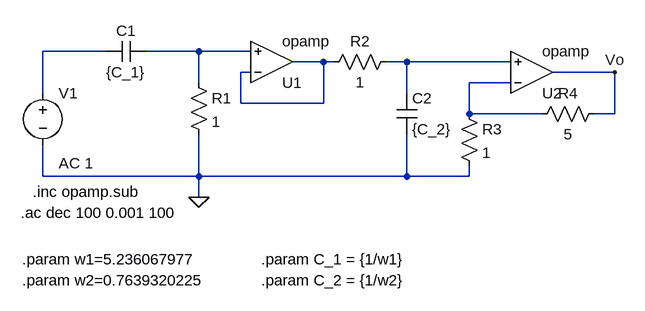
[diagram p0: schematic Ej3.asc]
Ej3.asc, the LTspice schematic file:
Version 4
SHEET 1 880 680
WIRE -32 144 -128 144
WIRE 112 144 32 144
WIRE 192 144 112 144
WIRE 304 160 256 160
WIRE 320 160 304 160
WIRE 432 160 400 160
WIRE 592 160 432 160
WIRE 192 176 176 176
WIRE 752 176 656 176
WIRE 112 192 112 144
WIRE 592 192 528 192
WIRE -128 208 -128 144
WIRE 432 208 432 160
WIRE 176 224 176 176
WIRE 304 224 304 160
WIRE 304 224 176 224
WIRE 528 240 528 192
WIRE 640 240 528 240
WIRE 752 240 752 176
WIRE 752 240 720 240
WIRE -128 336 -128 288
WIRE 112 336 112 272
WIRE 112 336 -128 336
WIRE 432 336 432 272
WIRE 432 336 112 336
WIRE 528 336 528 320
WIRE 528 336 432 336
WIRE 112 368 112 336
FLAG 112 368 0
FLAG 752 176 Vo
SYMBOL cap 32 128 R90
WINDOW 0 0 32 VBottom 2
WINDOW 3 32 32 VTop 2
SYMATTR InstName C1
SYMATTR Value {C_1}
SYMBOL res 96 176 R0
SYMATTR InstName R1
SYMATTR Value 1
SYMBOL OpAmps\\opamp 224 224 M180
SYMATTR InstName U1
SYMBOL res 416 144 R90
WINDOW 0 0 56 VBottom 2
WINDOW 3 32 56 VTop 2
SYMATTR InstName R2
SYMATTR Value 1
SYMBOL cap 416 208 R0
SYMATTR InstName C2
SYMATTR Value {C_2}
SYMBOL OpAmps\\opamp 624 240 M180
SYMATTR InstName U2
SYMBOL res 512 224 R0
SYMATTR InstName R3
SYMATTR Value 1
SYMBOL res 736 224 R90
WINDOW 0 0 56 VBottom 2
WINDOW 3 32 56 VTop 2
SYMATTR InstName R4
SYMATTR Value 5
SYMBOL voltage -128 192 R0
WINDOW 123 24 124 Left 2
WINDOW 39 0 0 Left 0
SYMATTR InstName V1
SYMATTR Value ""
SYMATTR Value2 AC 1
TEXT -144 360 Left 2 !.inc opamp.sub
TEXT -162 392 Left 2 !.ac dec 100 0.001 100
TEXT -160 464 Left 2 !.param w1=5.236067977
TEXT -160 496 Left 2 !.param w2=0.7639320225
TEXT 208 464 Left 2 !.param C_1 = {1/w1}
TEXT 208 496 Left 2 !.param C_2 = {1/w2}

The netlist it stands for:
* Ej3.asc
C1 N002 N001 {C_1}
R1 N002 0 1
XU1 N003 N002 N003 opamp Aol=100K GBW=10Meg  ; pins invin noninvin out
R2 N004 N003 1
C2 N004 0 {C_2}
XU2 N005 N004 Vo opamp Aol=100K GBW=10Meg  ; pins invin noninvin out
R3 N005 0 1
R4 Vo N005 5
V1 N001 0 AC 1
.inc opamp.sub
.ac dec 100 0.001 100
.param w1=5.236067977
.param w2=0.7639320225
.param C_1 = {1/w1}
.param C_2 = {1/w2}
.backanno
.end